# EAGLE design DR_EIB-128_MillMax (EAGLE 7.6.0)
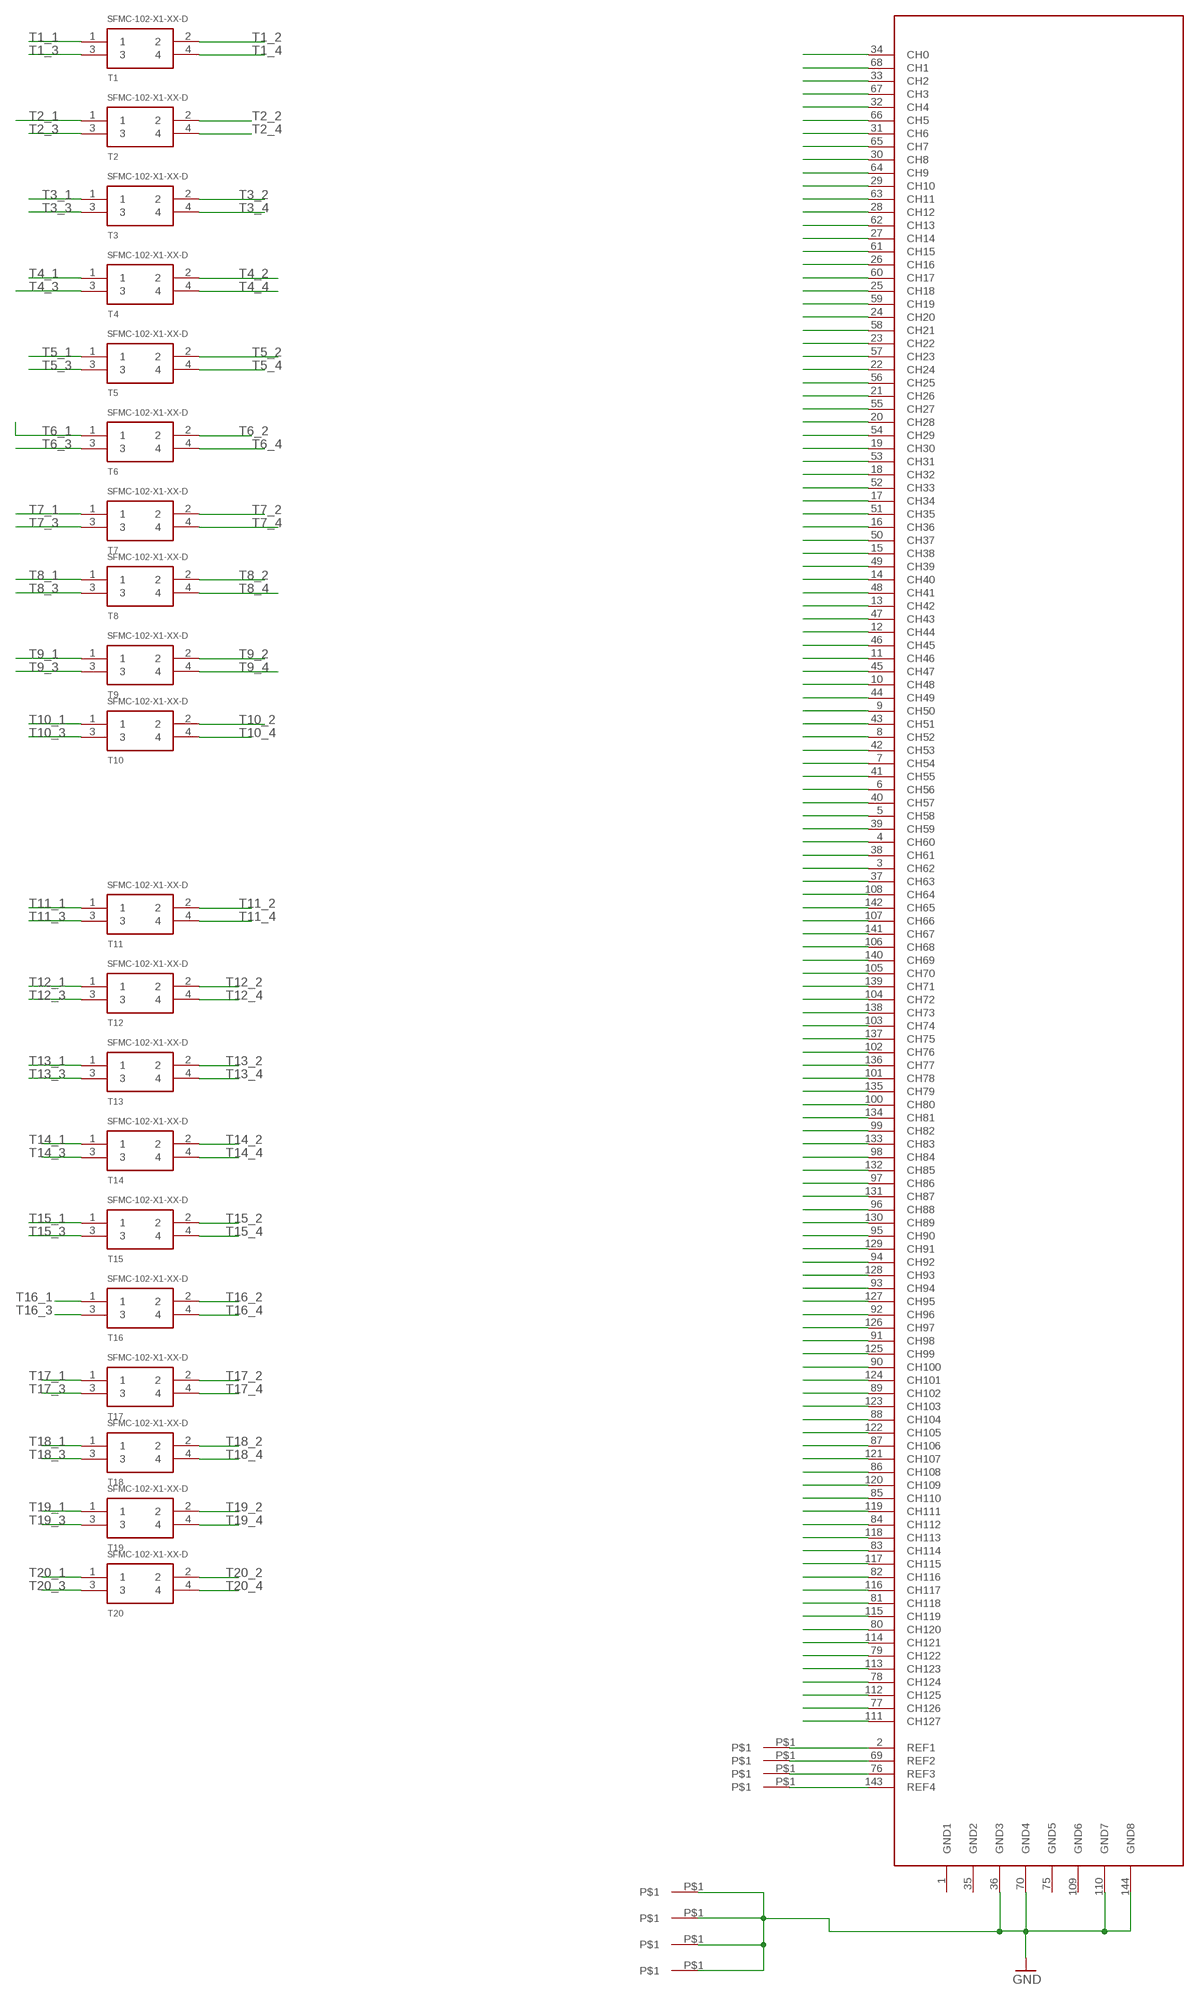
[diagram p0: schematic, sheet 1]

## Parts
T1  SFMC-102-X1-XX-D  [SFMC-102-X1-XX-D]
T2  SFMC-102-X1-XX-D  [SFMC-102-X1-XX-D]
T3  SFMC-102-X1-XX-D  [SFMC-102-X1-XX-D]
T4  SFMC-102-X1-XX-D  [SFMC-102-X1-XX-D]
T5  SFMC-102-X1-XX-D  [SFMC-102-X1-XX-D]
T6  SFMC-102-X1-XX-D  [SFMC-102-X1-XX-D]
T7  SFMC-102-X1-XX-D  [SFMC-102-X1-XX-D]
T8  SFMC-102-X1-XX-D  [SFMC-102-X1-XX-D]
T9  SFMC-102-X1-XX-D  [SFMC-102-X1-XX-D]
T10  SFMC-102-X1-XX-D  [SFMC-102-X1-XX-D]
T11  SFMC-102-X1-XX-D  [SFMC-102-X1-XX-D]
T12  SFMC-102-X1-XX-D  [SFMC-102-X1-XX-D]
T13  SFMC-102-X1-XX-D  [SFMC-102-X1-XX-D]
T14  SFMC-102-X1-XX-D  [SFMC-102-X1-XX-D]
T15  SFMC-102-X1-XX-D  [SFMC-102-X1-XX-D]
T16  SFMC-102-X1-XX-D  [SFMC-102-X1-XX-D]
T17  SFMC-102-X1-XX-D  [SFMC-102-X1-XX-D]
T18  SFMC-102-X1-XX-D  [SFMC-102-X1-XX-D]
T19  SFMC-102-X1-XX-D  [SFMC-102-X1-XX-D]
T20  SFMC-102-X1-XX-D  [SFMC-102-X1-XX-D]
U$1  TARRAYSHUTTLEHOLE  [TARRAYSHUTTLEHOLE]
U$2  TARRAYSHUTTLEHOLE  [TARRAYSHUTTLEHOLE]
U$3  128CH-MODULE  [128CH-MODULE]
U$4  TARRAYSHUTTLEHOLE  [TARRAYSHUTTLEHOLE]
U$5  TARRAYSHUTTLEHOLE  [TARRAYSHUTTLEHOLE]
U$6  TARRAYSHUTTLEHOLE  [TARRAYSHUTTLEHOLE]
U$7  TARRAYSHUTTLEHOLE  [TARRAYSHUTTLEHOLE]
U$8  TARRAYSHUTTLEHOLE  [TARRAYSHUTTLEHOLE]
U$9  TARRAYSHUTTLEHOLE  [TARRAYSHUTTLEHOLE]

## Nets
GND: U$1.P$1 U$2.P$1 U$3.36(GND3) U$3.70(GND4) U$3.110(GND7) U$3.144(GND8) U$4.P$1 U$5.P$1
N$1: U$3.2(REF1) U$6.P$1
N$2: U$3.69(REF2) U$7.P$1
N$3: U$3.76(REF3) U$8.P$1
N$4: U$3.143(REF4) U$9.P$1
T1_1: T1.1 U$3.37(CH63)
T1_2: T1.2 U$3.38(CH61)
T1_3: T1.3 U$3.39(CH59)
T1_4: T1.4 U$3.40(CH57)
T2_1: T2.1 U$3.6(CH56)
T2_2: T2.2 U$3.5(CH58)
T2_3: T2.3 U$3.4(CH60)
T2_4: T2.4 U$3.3(CH62)
T3_1: T3.1 U$3.7(CH54)
T3_2: T3.2 U$3.8(CH52)
T3_3: T3.3 U$3.9(CH50)
T3_4: T3.4 U$3.10(CH48)
T4_1: T4.1 U$3.11(CH46)
T4_2: T4.2 U$3.12(CH44)
T4_3: T4.3 U$3.13(CH42)
T4_4: T4.4 U$3.14(CH40)
T5_1: T5.1 U$3.15(CH38)
T5_2: T5.2 U$3.16(CH36)
T5_3: T5.3 U$3.17(CH34)
T5_4: T5.4 U$3.18(CH32)
T6_1: T6.1 U$3.93(CH94)
T6_2: T6.2 U$3.94(CH92)
T6_3: T6.3 U$3.95(CH90)
T6_4: T6.4 U$3.96(CH88)
T7_1: T7.1 U$3.97(CH86)
T7_2: T7.2 U$3.98(CH84)
T7_3: T7.3 U$3.99(CH82)
T7_4: T7.4 U$3.100(CH80)
T8_1: T8.1 U$3.101(CH78)
T8_2: T8.2 U$3.102(CH76)
T8_3: T8.3 U$3.103(CH74)
T8_4: T8.4 U$3.104(CH72)
T9_1: T9.1 U$3.108(CH64)
T9_2: T9.2 U$3.107(CH66)
T9_3: T9.3 U$3.106(CH68)
T9_4: T9.4 U$3.105(CH70)
T10_1: T10.1 U$3.139(CH71)
T10_2: T10.2 U$3.140(CH69)
T10_3: T10.3 U$3.141(CH67)
T10_4: T10.4 U$3.142(CH65)
T11_1: T11.1 U$3.111(CH127)
T11_2: T11.2 U$3.112(CH125)
T11_3: T11.3 U$3.113(CH123)
T11_4: T11.4 U$3.114(CH121)
T12_1: T12.1 U$3.80(CH120)
T12_2: T12.2 U$3.79(CH122)
T12_3: T12.3 U$3.78(CH124)
T12_4: T12.4 U$3.77(CH126)
T13_1: T13.1 U$3.81(CH118)
T13_2: T13.2 U$3.82(CH116)
T13_3: T13.3 U$3.83(CH114)
T13_4: T13.4 U$3.84(CH112)
T14_1: T14.1 U$3.85(CH110)
T14_2: T14.2 U$3.86(CH108)
T14_3: T14.3 U$3.87(CH106)
T14_4: T14.4 U$3.88(CH104)
T15_1: T15.1 U$3.89(CH102)
T15_2: T15.2 U$3.90(CH100)
T15_3: T15.3 U$3.91(CH98)
T15_4: T15.4 U$3.92(CH96)
T16_1: T16.1 U$3.19(CH30)
T16_2: T16.2 U$3.20(CH28)
T16_3: T16.3 U$3.21(CH26)
T16_4: T16.4 U$3.22(CH24)
T17_1: T17.1 U$3.23(CH22)
T17_2: T17.2 U$3.24(CH20)
T17_3: T17.3 U$3.25(CH18)
T17_4: T17.4 U$3.26(CH16)
T18_1: T18.1 U$3.27(CH14)
T18_2: T18.2 U$3.28(CH12)
T18_3: T18.3 U$3.29(CH10)
T18_4: T18.4 U$3.30(CH8)
T19_1: T19.1 U$3.34(CH0)
T19_2: T19.2 U$3.33(CH2)
T19_3: T19.3 U$3.32(CH4)
T19_4: T19.4 U$3.31(CH6)
T20_1: T20.1 U$3.65(CH7)
T20_2: T20.2 U$3.66(CH5)
T20_3: T20.3 U$3.67(CH3)
T20_4: T20.4 U$3.68(CH1)
T21_1: U$3.138(CH73)
T21_2: U$3.137(CH75)
T21_3: U$3.136(CH77)
T21_4: U$3.135(CH79)
T22_1: U$3.134(CH81)
T22_2: U$3.133(CH83)
T22_3: U$3.132(CH85)
T22_4: U$3.131(CH87)
T23_1: U$3.130(CH89)
T23_2: U$3.129(CH91)
T23_3: U$3.128(CH93)
T23_4: U$3.127(CH95)
T24_1: U$3.126(CH97)
T24_2: U$3.125(CH99)
T24_3: U$3.124(CH101)
T24_4: U$3.123(CH103)
T25_1: U$3.122(CH105)
T25_2: U$3.121(CH107)
T25_3: U$3.120(CH109)
T25_4: U$3.119(CH111)
T26_1: U$3.118(CH113)
T26_2: U$3.117(CH115)
T26_3: U$3.116(CH117)
T26_4: U$3.115(CH119)
T27_1: U$3.64(CH9)
T27_2: U$3.63(CH11)
T27_3: U$3.62(CH13)
T27_4: U$3.61(CH15)
T28_1: U$3.60(CH17)
T28_2: U$3.59(CH19)
T28_3: U$3.58(CH21)
T28_4: U$3.57(CH23)
T29_1: U$3.56(CH25)
T29_2: U$3.55(CH27)
T29_3: U$3.54(CH29)
T29_4: U$3.53(CH31)
T30_1: U$3.52(CH33)
T30_2: U$3.51(CH35)
T30_3: U$3.50(CH37)
T30_4: U$3.49(CH39)
T31_1: U$3.48(CH41)
T31_2: U$3.47(CH43)
T31_3: U$3.46(CH45)
T31_4: U$3.45(CH47)
T32_1: U$3.44(CH49)
T32_2: U$3.43(CH51)
T32_3: U$3.42(CH53)
T32_4: U$3.41(CH55)

## Power pins joined to a net without a drawn wire
GND1: U$3.1(GND1)
GND2: U$3.35(GND2)
GND5: U$3.75(GND5)
GND6: U$3.109(GND6)

## Library data of the parts
T1-T20 = UsefulConnectors:SFMC-102-X1-XX-D: 0.050" DOUBLE ROW SOCKET STRIP ASSEMBLY. MANUFACTURER: SAMTEC.
U$1 U$2 U$4-U$9 = UsefulConnectors:TARRAYSHUTTLEHOLE
U$3 = UsefulConnectors:128CH-MODULE

## Board
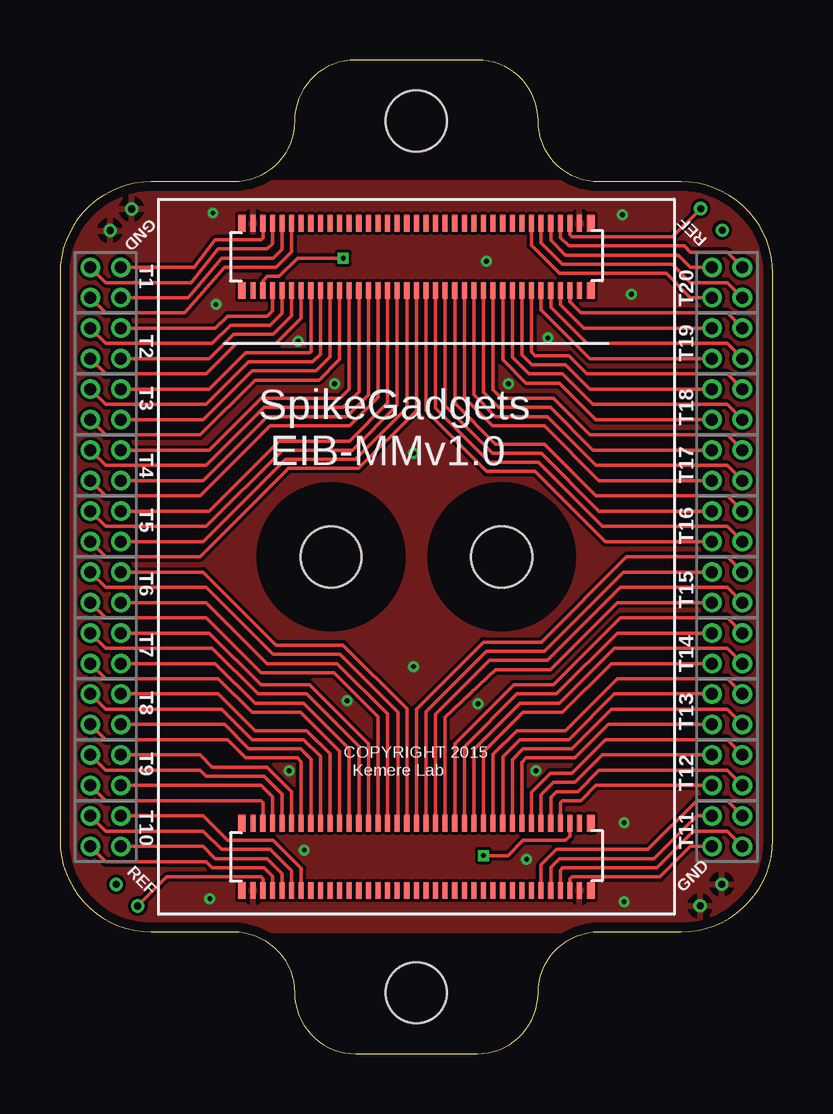
[diagram p1: board, top side]
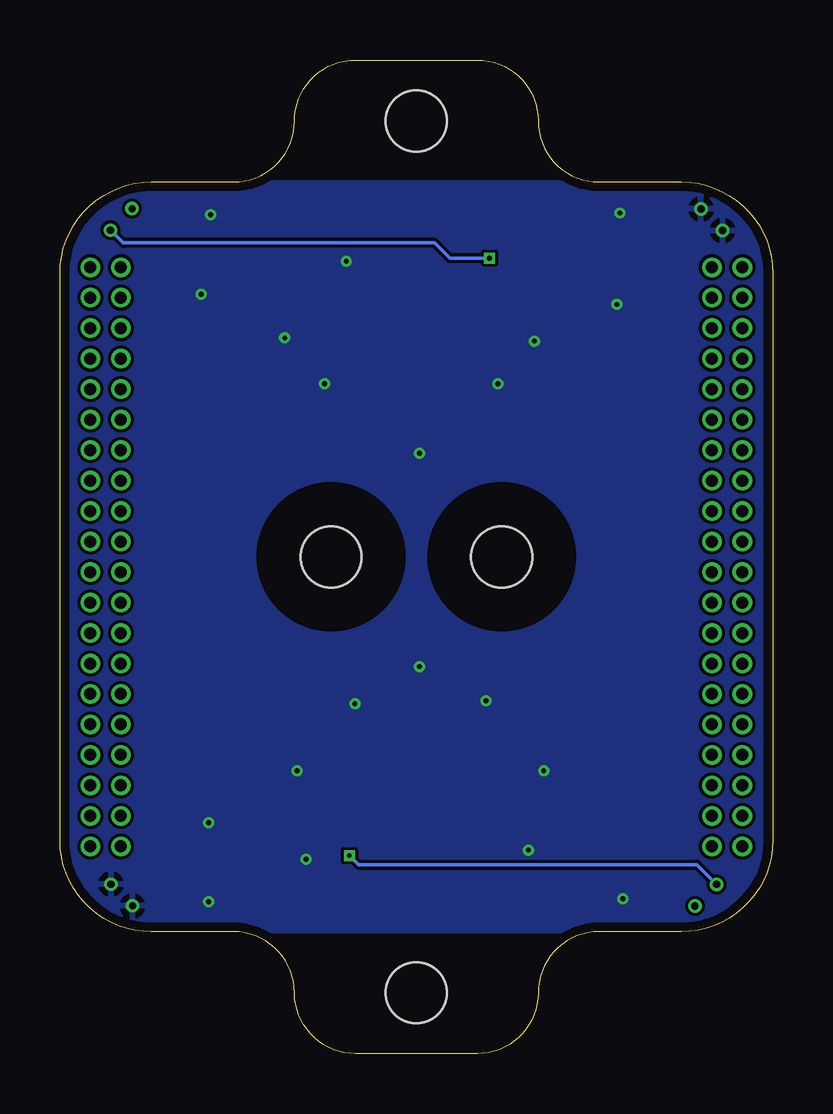
[diagram p2: board, bottom side, seen from below]

Size 29.72 x 41.4 mm. Coordinates in mm from the lower left corner, seen from the top.
Outline: 22.48,5.08 25.91,5.08 arc90 29.72,8.89 29.72,32.51 arc90 25.91,36.32 22.48,36.32 arc-90 19.94,38.86 arc90 17.4,41.4 12.32,41.4 arc90 9.78,38.86 arc-90 7.24,36.32 3.81,36.32 arc90 0,32.51 0,8.89 arc90 3.81,5.08 7.24,5.08 arc-90 9.78,2.54 arc90 12.32,0 17.4,0 arc90 19.94,2.54 arc-90 22.48,5.08
Copper layers (1*16): Top 0.035mm / dielectric 1.5mm / Bottom 0.035mm
Design rules "Mattias_EIB128": minimum track width 5mil, minimum drill 8mil, track to track 5mil, track to pad 5mil, pad to pad 5mil, via to via 5mil, smd to smd 5mil, copper to edge 15mil, drill to drill 8mil, minimum pad ring 5mil, minimum via ring 5mil, stop-mask expansion 4mil, vias tented up to drill 10mil, thermal gap 10mil
Holes 2.54 mm at 11.3,20.7 18.41,20.7 14.86,38.86 14.86,2.54
tRestrict: area 8.4,17.8 to 14.2,23.6; area 15.5,17.8 to 21.3,23.6
bRestrict: area 8.4,17.8 to 14.2,23.6; area 15.5,17.8 to 21.3,23.6

### Footprints (pad centres in the part's own frame; a part is rotated, then mirrored left to right if it is on the bottom)
SFMC-102-X1-XX-D = drill 0.5 pad 0.813: 1 0.635,-0.635; 2 0.635,0.635; 3 -0.635,-0.635; 4 -0.635,0.635
TARRAYSHUTTLEHOLE = drill 0.3: P$1 0,0
128CH-MODULE = smd 0.21 x 0.7: 1 -6.8,11.1; 2 -6.4,11.1; 3 -6,11.1; 4 -5.6,11.1; 5 -5.2,11.1; 6 -4.8,11.1; 7 -4.4,11.1; 8 -4,11.1; 9 -3.6,11.1; 10 -3.2,11.1; 11 -2.8,11.1; 12 -2.4,11.1; 13 -2,11.1; 14 -1.6,11.1; 15 -1.2,11.1; 16 -0.8,11.1; 17 -0.4,11.1; 18 0,11.1; 19 0.4,11.1; 20 0.8,11.1; 21 1.2,11.1; 22 1.6,11.1; 23 2,11.1; 24 2.4,11.1; 25 2.8,11.1; 26 3.2,11.1; 27 3.6,11.1; 28 4,11.1; 29 4.4,11.1; 30 4.8,11.1; 31 5.2,11.1; 32 5.6,11.1; 33 6,11.1; 34 6.4,11.1; 35 6.8,11.1; 36 -6.8,13.9; 37 -6.4,13.9; 38 -6,13.9; 39 -5.6,13.9; 40 -5.2,13.9; 41 -4.8,13.9; 42 -4.4,13.9; 43 -4,13.9; 44 -3.6,13.9; 45 -3.2,13.9; 46 -2.8,13.9; 47 -2.4,13.9; 48 -2,13.9; 49 -1.6,13.9; 50 -1.2,13.9; 51 -0.8,13.9; 52 -0.4,13.9; 53 0,13.9; 54 0.4,13.9; 55 0.8,13.9; 56 1.2,13.9; 57 1.6,13.9; 58 2,13.9; 59 2.4,13.9; 60 2.8,13.9; 61 3.2,13.9; 62 3.6,13.9; 63 4,13.9; 64 4.4,13.9; 65 4.8,13.9; 66 5.2,13.9; 67 5.6,13.9; 68 6,13.9; 69 6.4,13.9; 70 6.8,13.9; 75 6.8,-11.1; 76 6.4,-11.1; 77 6,-11.1; 78 5.6,-11.1; 79 5.2,-11.1; 80 4.8,-11.1; 81 4.4,-11.1; 82 4,-11.1; 83 3.6,-11.1; 84 3.2,-11.1; 85 2.8,-11.1; 86 2.4,-11.1; 87 2,-11.1; 88 1.6,-11.1; 89 1.2,-11.1; 90 0.8,-11.1; 91 0.4,-11.1; 92 0,-11.1; 93 -0.4,-11.1; 94 -0.8,-11.1; 95 -1.2,-11.1; 96 -1.6,-11.1; 97 -2,-11.1; 98 -2.4,-11.1; 99 -2.8,-11.1; 100 -3.2,-11.1; 101 -3.6,-11.1; 102 -4,-11.1; 103 -4.4,-11.1; 104 -4.8,-11.1; 105 -5.2,-11.1; 106 -5.6,-11.1; 107 -6,-11.1; 108 -6.4,-11.1; 109 -6.8,-11.1; 110 6.8,-13.9; 111 6.4,-13.9; 112 6,-13.9; 113 5.6,-13.9; 114 5.2,-13.9; 115 4.8,-13.9; 116 4.4,-13.9; 117 4,-13.9; 118 3.6,-13.9; 119 3.2,-13.9; 120 2.8,-13.9; 121 2.4,-13.9; 122 2,-13.9; 123 1.6,-13.9; 124 1.2,-13.9; 125 0.8,-13.9; 126 0.4,-13.9; 127 0,-13.9; 128 -0.4,-13.9; 129 -0.8,-13.9; 130 -1.2,-13.9; 131 -1.6,-13.9; 132 -2,-13.9; 133 -2.4,-13.9; 134 -2.8,-13.9; 135 -3.2,-13.9; 136 -3.6,-13.9; 137 -4,-13.9; 138 -4.4,-13.9; 139 -4.8,-13.9; 140 -5.2,-13.9; 141 -5.6,-13.9; 142 -6,-13.9; 143 -6.4,-13.9; 144 -6.8,-13.9 | smd 0.33 x 0.7: 71 -7.275,11.1; 72 7.275,11.1; 73 -7.275,13.9; 74 7.275,13.9; 145 7.275,-11.1; 146 -7.275,-11.1; 147 7.275,-13.9; 148 -7.275,-13.9

### Placement (x,y rotation side)
T1  1.91,32.13 90 top
T2  1.91,29.59 270 top
T3  1.91,27.05 90 top
T4  1.91,24.51 90 top
T5  1.91,21.97 90 top
T6  1.91,19.43 90 top
T7  1.91,16.89 90 top
T8  1.91,14.35 90 top
T9  1.91,11.81 270 top
T10  1.91,9.27 90 top
T11  27.81,9.27 270 top
T12  27.81,11.81 90 top
T13  27.81,14.35 270 top
T14  27.81,16.89 270 top
T15  27.81,19.43 270 top
T16  27.81,21.97 270 top
T17  27.81,24.51 270 top
T18  27.81,27.05 270 top
T19  27.81,29.59 90 top
T20  27.81,32.13 270 top
U$1  26.69,6.16 45 top
U$2  27.59,7.06 45 top
U$3  14.86,20.7 0 top
U$4  2.99,35.19 45 top
U$5  2.09,34.3 45 top
U$6  27.61,34.31 135 top
U$7  26.71,35.21 135 top
U$8  2.34,7.05 315 top
U$9  3.24,6.15 315 top

### Tracks (layer width: path | path; a pad name or v marks a point on that pad's centre or on a via)
GND  (via drill 0.2)
  other vias: 6.38,35.03 23.44,34.95 17.42,14.58 11.96,14.71 6.25,6.45 23.52,6.32 19.84,11.79 9.55,11.79 14.73,16.13 14.73,25.02 20.35,29.82 18.69,27.91 11.46,27.91 9.93,29.69 19.46,8.1 23.52,9.63 10.19,8.48 6.5,31.22 23.83,31.65 17.78,33.02
  pour Bottom: 0,5.08 29.72,5.08 29.72,36.32 0,36.32
  pour Top: 0,5.08 29.72,5.08 29.72,36.32 0,36.32
N$1  (via drill 0.2)
  Top 0.152: U$3.2 8.46,32.21 8.64,32.38 9.14,32.38 9.91,33.15 v11.81,33.15
  Bottom 0.152: v11.81,33.15 13.46,33.15 14.1,33.78 27.08,33.78 U$6.P$1
N$2
  Top 0.152: U$3.69 21.26,34.11 21.34,34.04 25.54,34.04 U$7.P$1
N$3  (via drill 0.2)
  Top 0.152: U$3.76 21.26,9.07 21.08,8.89 19.3,8.89 18.67,8.26 v17.65,8.26
  Bottom 0.152: v17.65,8.26 17.27,7.87 3.17,7.87 U$8.P$1
N$4
  Top 0.152: U$3.143 8.46,7.29 8.38,7.37 4.45,7.37 U$9.P$1
T1_1
  Top 0.152: T1.1 5.59,32.77 6.48,33.91 8.38,33.91 8.46,33.99 U$3.37
T1_2
  Top 0.152: T1.2 1.91,32.13 5.46,32.13 6.6,33.53 8.64,33.53 8.86,33.75 U$3.38
T1_3
  Top 0.152: T1.3 5.33,31.5 6.73,33.15 8.89,33.15 9.26,33.52 U$3.39
T1_4
  Top 0.152: T1.4 1.91,30.86 5.21,30.86 6.86,32.77 9.02,32.77 9.66,33.41 U$3.40
T2_1
  Top 0.152: U$3.6 10.06,30.63 9.02,29.59 7.37,29.59 6.1,28.32 1.91,28.32 T2.1
T2_2
  Top 0.152: T2.2 6.22,28.96 7.24,29.97 8.89,29.97 9.66,30.74 U$3.5
T2_3
  Top 0.152: U$3.4 9.26,30.85 8.76,30.35 7.11,30.35 6.35,29.59 1.91,29.59 T2.3
T2_4
  Top 0.152: U$3.3 8.86,30.96 8.64,30.73 6.99,30.73 6.48,30.23 T2.4
T3_1
  Top 0.152: U$3.7 10.46,29.25 10.41,29.21 7.75,29.21 6.22,27.69 T3.1
T3_2
  Top 0.152: U$3.8 10.86,29.15 10.54,28.83 7.87,28.83 6.1,27.05 1.91,27.05 T3.2
T3_3
  Top 0.152: T3.3 5.97,26.42 8,28.45 10.67,28.45 11.26,29.04 U$3.9
T3_4
  Top 0.152: U$3.10 11.66,28.93 10.79,28.07 8.13,28.07 5.84,25.78 1.91,25.78 T3.4
T4_1
  Top 0.152: T4.1 6.22,25.15 8.38,27.3 11.68,27.3 12.06,27.68 U$3.11
T4_2
  Top 0.152: U$3.12 12.46,27.57 11.81,26.92 8.51,26.92 6.1,24.51 1.91,24.51 T4.2
T4_3
  Top 0.152: U$3.13 12.86,27.46 11.94,26.54 8.64,26.54 5.97,23.88 T4.3
T4_4
  Top 0.152: U$3.14 13.26,27.36 12.06,26.16 8.76,26.16 5.84,23.24 1.91,23.24 T4.4
T5_1
  Top 0.152: U$3.15 13.66,27.12 12.06,25.53 9.14,25.53 6.22,22.61 T5.1
T5_2
  Top 0.152: U$3.16 14.06,27.01 12.19,25.15 9.27,25.15 6.1,21.97 1.91,21.97 T5.2
T5_3
  Top 0.152: U$3.17 14.46,26.91 12.32,24.77 9.4,24.77 5.97,21.34 T5.3
T5_4
  Top 0.152: U$3.18 14.86,26.8 12.45,24.38 9.53,24.38 5.84,20.7 1.91,20.7 T5.4
T6_1
  Top 0.152: U$3.93 14.46,14.37 11.81,17.02 9.02,17.02 5.97,20.07 T6.1
T6_2
  Top 0.152: U$3.94 14.1,9.78 14.1,14.22 11.68,16.64 8.89,16.64 6.1,19.43 1.91,19.43 T6.2
T6_3
  Top 0.152: U$3.95 13.66,14.15 11.56,16.26 8.64,16.26 6.1,18.8 T6.3
T6_4
  Top 0.152: U$3.96 13.26,14.05 11.43,15.88 8.38,15.88 6.1,18.16 1.91,18.16 T6.4
T7_1
  Top 0.152: T7.1 6.22,17.53 8.38,15.37 10.41,15.37 12.86,12.92 U$3.97
T7_2
  Top 0.152: T7.2 1.91,16.89 6.35,16.89 8.26,14.99 10.29,14.99 12.46,12.81 U$3.98
T7_3
  Top 0.152: U$3.99 12.06,12.71 10.16,14.61 8.13,14.61 6.48,16.26 T7.3
T7_4
  Top 0.152: U$3.100 11.66,12.6 10.03,14.22 8,14.22 6.6,15.62 1.91,15.62 T7.4
T8_1
  Top 0.152: U$3.101 11.26,12.49 10.29,13.46 8.13,13.46 6.6,14.99 T8.1
T8_2
  Top 0.152: U$3.102 10.86,12.38 10.16,13.08 8,13.08 6.73,14.35 1.91,14.35 T8.2
T8_3
  Top 0.152: U$3.103 10.46,12.27 10.03,12.7 7.87,12.7 6.86,13.72 T8.3
T8_4
  Top 0.152: U$3.104 10.06,12.17 9.91,12.32 7.75,12.32 6.99,13.08 1.91,13.08 T8.4
T9_1
  Top 0.152: 8.46,10.08 U$3.108 8.46,10.46 8.38,10.54 1.91,10.54 T9.1
T9_2
  Top 0.152: U$3.107 8.86,10.7 8.38,11.18 T9.2
T9_3
  Top 0.152: U$3.106 9.26,10.81 8.51,11.56 6.1,11.56 5.84,11.81 1.91,11.81 T9.3
T9_4
  Top 0.152: U$3.105 9.66,10.91 8.64,11.94 6.35,11.94 5.84,12.45 T9.4
T10_1
  Top 0.152: U$3.139 10.06,7.72 8.89,8.89 6.99,8.89 5.97,9.91 T10.1
T10_2
  Top 0.152: U$3.140 9.66,7.23 9.65,7.24 9.65,7.62 8.76,8.51 6.73,8.51 5.97,9.27 1.91,9.27 T10.2
T10_3
  Top 0.152: 9.26,7.25 U$3.141 9.26,7.5 8.64,8.13 6.48,8.13 5.97,8.64 T10.3
T10_4
  Top 0.152: U$3.142 8.86,7.4 8.51,7.75 6.35,7.75 6.1,8 1.91,8 T10.4
T11_1
  Top 0.152: T11.1 26.29,8.64 25.02,7.37 21.34,7.37 21.26,7.29 U$3.111
T11_2
  Top 0.127: U$3.112
  Top 0.152: T11.2 27.81,9.27 26.42,9.27 24.89,7.75 20.95,7.75 20.86,7.65 U$3.112
T11_3
  Top 0.127: 20.45,6.81 U$3.113
  Top 0.152: U$3.113 20.46,7.76 20.83,8.13 24.77,8.13 26.54,9.91 T11.3
T11_4
  Top 0.127: 20.07,6.73 U$3.114
  Top 0.152: T11.4 27.81,10.54 26.54,10.54 24.51,8.51 20.7,8.51 20.06,7.87 U$3.114
T12_1
  Top 0.152: T12.1 27.81,13.08 22.73,13.08 21.34,11.68 20.45,11.68 19.66,10.9 U$3.80
T12_2
  Top 0.152: T12.2 22.61,12.45 21.46,11.3 20.57,11.3 20.06,10.79 U$3.79
T12_3
  Top 0.152: T12.3 27.81,11.81 22.48,11.81 21.59,10.92 20.7,10.92 20.46,10.68 U$3.78
T12_4
  Top 0.152: U$3.77 20.86,10.45 20.95,10.54 21.72,10.54 22.35,11.18 T12.4
T13_1
  Top 0.152: T13.1 22.86,13.72 21.46,12.32 19.43,12.32 19.26,12.15 U$3.81
T13_2
  Top 0.152: T13.2 27.81,14.35 22.99,14.35 21.34,12.7 19.3,12.7 18.86,12.26 U$3.82
T13_3
  Top 0.152: U$3.83 18.46,12.36 19.18,13.08 21.21,13.08 23.11,14.99 T13.3
T13_4
  Top 0.152: T13.4 27.81,15.62 23.24,15.62 21.08,13.46 19.05,13.46 18.06,12.47 U$3.84
T14_1
  Top 0.152: U$3.85 17.66,12.58 19.3,14.22 20.95,14.22 22.99,16.26 T14.1
T14_2
  Top 0.152: T14.2 27.81,16.89 23.11,16.89 20.83,14.61 19.18,14.61 17.26,12.69 U$3.86
T14_3
  Top 0.152: U$3.87 16.86,12.79 19.05,14.99 20.7,14.99 23.24,17.53 T14.3
T14_4
  Top 0.152: T14.4 27.81,18.16 23.37,18.16 20.57,15.37 18.92,15.37 16.46,12.9 U$3.88
T15_1
  Top 0.152: U$3.89 16.06,14.03 18.16,16 20.45,16 23.24,18.8 T15.1
T15_2
  Top 0.152: T15.2 27.81,19.43 23.37,19.43 20.32,16.38 17.91,16.38 15.66,14.13 U$3.90
T15_3
  Top 0.152: U$3.91 15.26,14.24 17.78,16.76 20.19,16.76 23.5,20.07 T15.3
T15_4
  Top 0.152: T15.4 27.81,20.7 23.62,20.7 20.07,17.14 17.65,17.14 14.86,14.35 U$3.92
T16_1
  Top 0.152: U$3.19 15.26,26.78 17.78,24.26 19.81,24.26 22.73,21.34 T16.1
T16_2
  Top 0.152: T16.2 27.81,21.97 22.61,21.97 19.94,24.64 17.91,24.64 15.66,26.89 U$3.20
T16_3
  Top 0.152: U$3.21 16.06,26.99 18.03,25.02 20.07,25.02 22.48,22.61 T16.3
T16_4
  Top 0.152: T16.4 27.81,23.24 22.35,23.24 20.19,25.4 18.16,25.4 16.46,27.1 U$3.22
T17_1
  Top 0.152: U$3.23 16.86,27.34 18.03,26.16 20.19,26.16 22.48,23.88 T17.1
T17_2
  Top 0.152: T17.2 27.81,24.51 22.35,24.51 20.32,26.54 18.16,26.54 17.26,27.45 U$3.24
T17_3
  Top 0.152: U$3.25 17.66,27.55 18.29,26.92 20.45,26.92 22.23,25.15 T17.3
T17_4
  Top 0.152: U$3.26 18.06,27.66 18.41,27.3 20.57,27.3 22.1,25.78 27.81,25.78 T17.4
T18_1
  Top 0.152: U$3.27 18.46,28.91 19.43,27.94 20.83,27.94 22.35,26.42 T18.1
T18_2
  Top 0.152: T18.2 27.81,27.05 22.23,27.05 20.95,28.32 19.56,28.32 18.86,29.02 U$3.28
T18_3
  Top 0.152: T18.3 22.1,27.69 21.08,28.7 19.68,28.7 19.26,29.13 U$3.29
T18_4
  Top 0.152: T18.4 27.81,28.32 21.97,28.32 21.21,29.08 19.81,29.08 19.66,29.24 U$3.30
T19_1
  Top 0.152: T19.1 27.81,30.86 21.72,30.86 21.26,31.32 U$3.34
T19_2
  Top 0.152: U$3.33 20.86,31.21 21.84,30.23 T19.2
T19_3
  Top 0.152: T19.3 27.81,29.59 21.97,29.59 20.46,31.1 U$3.32
T19_4
  Top 0.152: U$3.31 20.06,31 22.1,28.96 T19.4
T20_1
  Top 0.152: T20.1 26.29,31.5 25.27,32.51 20.83,32.51 19.66,33.68 U$3.65
T20_2
  Top 0.152: T20.2 27.81,32.13 26.29,32.13 25.53,32.89 20.95,32.89 20.06,33.79 U$3.66
T20_3
  Top 0.152: T20.3 26.29,32.77 25.78,33.27 21.08,33.27 20.46,33.9 U$3.67
T20_4
  Top 0.152: T20.4 27.81,33.4 26.29,33.4 26.04,33.66 21.21,33.66 20.86,34.01 U$3.68

### Text on the board
tPlace: GND | REF | SpikeGadgets / EIB-MMv1.0 | COPYRIGHT 2015 / Kemere Lab | REF | GND